# Altium schematic sheet Sheet1.SchDoc
size A4; SheetNumber: 1; SheetTotal: 1
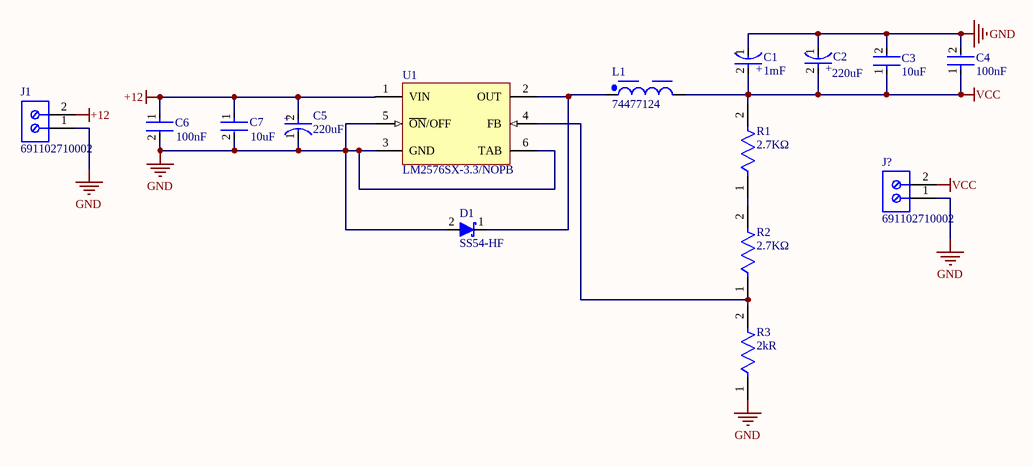
[diagram p0: Sheet1.SchDoc]

## Parts
C1  Capacitance: 1mF  [FP-FKF-MFG]  (hidden comment: EEE-FK0J102P)
C2  Capacitance: 220uF  [FP-FC-G-MFG]  (hidden comment: EEE-FC1V221P)
C3  Capacitance: 10uF  [FP-C0805C-DG-MFG]  (hidden comment: C0805C106K8PACTU)
C4  Capacitance: 100nF  [FP-0805-L_2_01_0_2-W_1_25-MFG]  (hidden comment: 08055C104JAT2A)
C5  Capacitance: 220uF  [FP-FC-G-MFG]  (hidden comment: EEE-FC1V221P)
C6  Capacitance: 100nF  [FP-0805-L_2_01_0_2-W_1_25-MFG]  (hidden comment: 08055C104JAT2A)
C7  Capacitance: 10uF  [FP-C0805C-DG-MFG]  (hidden comment: C0805C106K8PACTU)
D1  SS54-HF  [DIOM5025X220N]
J1  691102710002  [691102710002]
J?  691102710002  [691102710002]
L1  74477124  [WE-PD_1260]
R1  Resistance: 2.7KΩ  [FP-RT0603-MFG]  (hidden comment: RT0603FRE072K7L)
R2  Resistance: 2.7KΩ  [FP-RT0603-MFG]  (hidden comment: RT0603FRE072K7L)
R3  Resistance: 2kR  [FP-CRCW0603-HPe3-IPC_C]  (hidden comment: CRCW06032K00FKEAHP)
U1  LM2576SX-3.3/NOPB  [KTT0005B_L]

## Nets
+12: C5.2(A) C6.1 C7.1 J1.2 U1.1(VIN)
GND: C1.1(C) C2.1(C) C3.2 C4.2 C5.1(C) C6.2 C7.2 D1.2(A) J1.1 J?.1 R3.1 U1.3(GND) U1.5(~{ON}/OFF) U1.6(TAB)
VCC: C1.2(A) C2.2(A) C3.1 C4.1 J?.2 L1.2 R1.2
NetD1_1: D1.1(K) L1.1 U1.2(OUT)
NetR1_1: R1.1 R2.2
NetR2_1: R2.1 R3.2 U1.4(FB)

## Notes on the sheet
- (in symbol CMP-00287-39480966-1) +
- (in symbol CMP-05427-002152-1) +

## Library data of the parts
C1 = CMP-00287-39480966-1: EEE-FK0J102P Aluminum Electrolytic Capacitor, 1000 uF, 6.3 V, ± 20%, 2000 hours @ 105°C, Radial Can - SMD; Voltage Rating (DC): 6.3V; Dissipation Factor: 26%; Ripple Current: 600mA; Impedance: 160mΩ; Leakage Current: 3µA; Width: 10mm; Height: 10.2mm; Lifecycle Status: Production; Height - Seated (Max): 10.2108mm; REACH SVHC: No SVHC; NexarPartId: 39480966; Radiation Hardening: No; Length: 10.2mm; Max Operating Temperature: 105°C; Packaging: Cut Tape; Number of Pins: 2; Schedule B: 8532220020, 8532220020; Min Operating Temperature: -55°C; Lead Free: Lead Free; Tolerance: 20%; Case/Package: Radial; Life (Hours): 2000hours; Mount: PCB, Surface Mount; Ripple Current (AC): 600mA; Voltage: 6.3V; Diameter: 8mm; Contact Plating: Tin; Termination: SMD/SMT; ESR (Equivalent Series Resistance): 160mΩ; Voltage Rating: 6.3V; RoHS: Compliant
C2 C5 = CMP-05427-002152-1: CAP ALUM 220UF 20% 35V SMD; Life (Hours): 1000Hour; Leakage Current: 3uA; Ripple Current (AC): 670mA; Material: Aluminium; Impedance: 150mR; Mount: Surface Mount; Construction: Cylindrical; Ratings: AEC-Q200; Radiation Hardening: No; Height: 10.2mm; Height - Seated (Max): 0.402inch; Termination: SMD/SMT; Tolerance: 20%; Packaging: Tape and Reel; Min Operating Temperature: -40°C; Voltage: 35V; Case/Package: Radial; Length: 10.5mm; Ripple Current: 670mA; Contact Plating: Tin; Width: 900um; Voltage Rating (DC): 35V; Diameter: 10mm; Package Quantity: 500; Lead Free: Lead Free; Reach SVHC Compliant: Yes; Series: FC; Max Operating Temperature: 105°C; Voltage Rating: 35V; RoHS Compliant: Yes; ESR (Equivalent Series Resistance): 150mR
C3 C7 = CMP-2007-03243-2: CAP CER 10UF 10V X5R 0805; Manufacturer: Kemet; 3DS Part Number: 220-00001; Tolerance: 10%; Temperature Coefficient: 15%; Material: Ceramic; Device Class L2: Capacitors; Device Class L1: Passive Components; ComponentLink2URL: https://content.kemet.com/datasheets/KEM_C1006_X5R_SMD.pdf; Height: 1.4mm; Lead Free: Yes; Manufacturer Part Number: C0805C106K8PACTU; Digikey Description: CAP CER 10UF 10V X5R 0805; Octopart: https://octopart.com/c0805c106k8pactu-kemet-98697; Value: 10uF; Temperature Range Low: -55°C; Temperature: -55°C to +85°C; Automotive: No; Mouser Description: CAP CER 10UF 10V X5R 0805; Ipc Land Pattern Name: CAPC200125X125; Temperature Range High: +85°C; Voltage: 10V; RoHS: TRUE; Device Class L3: Ceramic Capacitors; ComponentLink2Description: Datasheet; Voltage Rating: 10V; Package: C0805C-DG; Temperature Characteristic: X5R; Category: Cap
C4 C6 = CMP-2000-05808-2: General Purpose Ceramic Capacitor, 0805, 100nF, 5%, X7R, 0.15, 50V; Dissipation Factor: 2.5%; Insulation Resistance: 100GR; Length: 2.01mm; Min Operating Temperature: -55°C; Number of Pins: 2; Width: 0.049inch; Height: 0.94mm; Max Operating Temperature: 125°C; RoHS Compliant: Yes; Depth: 1.25mm; Radiation Hardening: No; Case Code (Metric): 2012; Case/Package: 0805; Contact Plating: Tin; Mount: Surface Mount; Tolerance: 5%; Dielectric Material: Ceramic; Case Code (Imperial): 0805; Dielectric: X7R; Voltage Rating: 50V; REACH SVHC: No SVHC; Thickness: 0.037inch; Voltage Rating (DC): 50V; Lead Free: Lead Free; Package Quantity: 1; Packaging: Tape and Reel; Voltage: 50V; Termination: SMD/SMT
D1 = SS54-HF: Diode Schottky 40 V 5A Surface Mount DO-214AC (SMA); MF: Comchip Technology; MP: SS54-HF; Value: *; Check_prices: https://www.snapeda.com/parts/SS54-HF/Comchip+Technology/view-part/?ref=eda; Package: DO-214AC-214 Comchip Technology; Purchase-URL: https://pricing.snapeda.com/search/part/SS54-HF/?ref=eda; Availability: In Stock; Price: None; SnapEDA_Link: https://www.snapeda.com/parts/SS54-HF/Comchip+Technology/view-part/?ref=snap
J1 J? = CMP-1502-03258-2: NexarPartId: 8917706; Number of Levels: 1; Number of Positions Per Level: 2; Current: 15A; Voltage: 300V; Pitch: 5.0038mm; Plating: Steel; Stripping Length: -6mm; Wire Gauge (Min): 14AWG; Wire Gauge (Max): 22AWG; Length: 7.5mm; Contact Material: Brass; Contact Plating: Tin; Packaging: Box; Number of Pins: 2; Voltage Rating: 300V; Termination: Screw; Number of Contacts: 2; Color: Blue; Current Rating: 15A; Mount: Through Hole; Max Operating Temperature: 105°C; Min Operating Temperature: -40°C; REACH SVHC: Unknown; Height: 13.4mm; Width: 11.2mm; Housing Material: Nylon; RoHS: Compliant; Wire/Cable Gauge: 22AWG; Lead Pitch: 5mm
L1 = CMP-0227-00690-2: NexarPartId: 8917138; Inductance: 470µH; Self Resonant Frequency: 2.6MHz; Core Material: Ferrite; Max DC Current: 640mA; Test Frequency: 1kHz; Series Resistance: 770mΩ; Inductance Tolerance: 20%; Saturation Current: 800mA; DC Resistance (DCR): 590mΩ; Current Rating: 700mA; Shielding: Shielded; REACH SVHC: Unknown; Termination: SMD/SMT; Min Operating Temperature: -40°C; Weight: 4.535924g; Ambient Temperature Range High: 85°C; Height: 6mm; Width: 12mm; Number of Pins: 2; Depth: 12mm; Packaging: Tape & Reel (TR); Length: 12mm; RoHS: Compliant; Case/Package: Nonstandard; Ambient Temperature Range Low: -40°C; Mount: Surface Mount; Tolerance: 20%; Composition: Wirewound; Max Operating Temperature: 125°C; RMS Current (Irms): 640mA; Resistance: 770mΩ; Height - Seated (Max): 5.9944mm
R1 R2 = CMP-03412-029269-1: RES SMD 2.7K OHM 1% 1/10W 0603; Manufacturer: Yageo; Power Rating: 0.1W; Tolerance: 0.01; Value: 2.7KΩ; Temperature Coefficient: 50 ppm/°C; Voltage Rating: 75V; Series: RT; Height: 0.55mm; Digikey Description: RES SMD 2.7K OHM 1% 1/10W 0603; Device Class L2: Resistors; Composition: Thin Film; Device Class L3: Chip SMD Resistors; Temperature: -55°C to +155°C; Temperature Range Low: -55°C; RoHS: TRUE; Lead Free: Yes; Ipc Land Pattern Name: RESC16080X45; Octopart: https://octopart.com/rt0603fre072k7l-yageo-39866772; ComponentLink2URL: http://www.yageo.com/documents/recent/PYu-RT_1-to-0.01_RoHS_L_9.pdf; Package: RT0603; Footprint Url: http://www.yageo.com/exep/pages/download/literatures/PYu-R_Mount_10.pdf; Manufacturer Part Number: RT0603FRE072K7L; Category: Res; Mouser Description: Thin Film Resistors - SMD 1/10W 2.7K ohm 1% 50ppm; Temperature Range High: +155°C; ComponentLink2Description: Datasheet; Device Class L1: Passive Components; Automotive: No
R3 = CMP-2000-03160-2: RES Thick Film, 2kΩ, 1%, 0.33W, 100ppm/°C, 0603; Max Power Dissipation: 250mW; Voltage Rating: 75V; Radiation Hardening: No; Min Operating Temperature: -55°C; Features: Automotive AEC-Q200; Tolerance: 1%; Width: 0.033inch; Military Standard: Not; Weight: 7.1E-05oz; Lead Free: Lead Free; Length: 1.6mm; Package Quantity: 10; Composition: Thick Film; Mount: Surface Mount; Depth: 0.85mm; Case Code (Metric): 1608; Case Code (Imperial): 0603; Max Operating Temperature: 155°C; Power Rating: 250mW; Termination: Solder; Height: 0.45mm; Temperature Coefficient: 100ppm/°C; Packaging: Tape and Reel; Case/Package: 0603; Contact Plating: Tin; Number of Terminations: 2
U1 = CMP-0069-00110-3: SIMPLE SWITCHER® 3A Step-Down Voltage Regulator, 5-pin TO-263, Pb-Free; Manufacturer: Texas Instruments; PowerWise: N; PackageTopMarking: NSUZXYTTE#*LM2576S*-3.3 P+; PackageReference: KTT0005B; ComponentLink1Description: Datasheet URL; PinCount: 5; Code_JEDEC: MO-169-AB; CompType: Switcher; RoHS: Y; PackageDescription: TO-263, Molded, .400 x .390 x .180in, 5 Lead, .067in Pitch, Surface Mount; ComponentLink1URL: http://www.ti.com/general/docs/lit/getliterature.tsp?genericPartNumber=LM2576&fileType=pdf